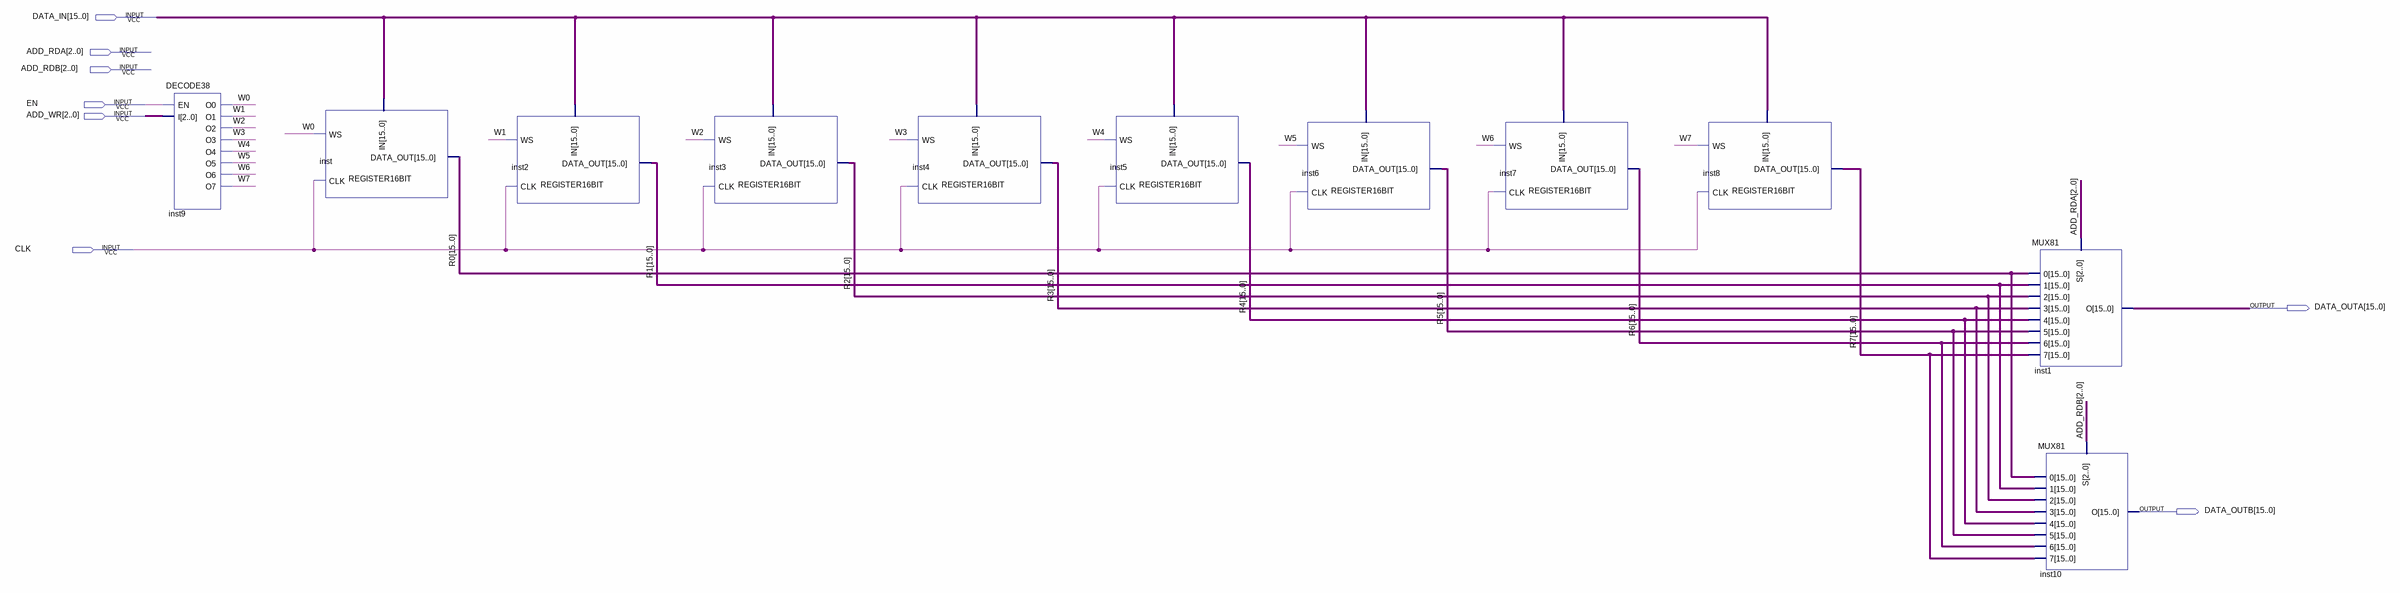
[diagram p0: schematic sheet]
// Quartus schematic RF8X16.bdf as structural Verilog: 11 symbols, 8 pins
module RF8X16 (
  input  [15:0] DATA_IN,
  input  [2:0] ADD_RDA,
  input  [2:0] ADD_RDB,
  input  EN,
  input  [2:0] ADD_WR,
  input  CLK,
  output [15:0] DATA_OUTA,
  output [15:0] DATA_OUTB
);

  wire W0, W1, W2, W3, W4, W5, W6, W7;
  wire [15:0] R0, R1, R2, R3, R4, R5, R6, R7;

  DECODE38 inst9 (.EN(EN), .I(ADD_WR), .O0(W0), .O1(W1), .O2(W2), .O3(W3), .O4(W4), .O5(W5), .O6(W6), .O7(W7));
  REGISTER16BIT inst (.IN(DATA_IN), .WS(W0), .CLK(CLK), .DATA_OUT(R0));
  REGISTER16BIT inst2 (.IN(DATA_IN), .WS(W1), .CLK(CLK), .DATA_OUT(R1));
  REGISTER16BIT inst3 (.IN(DATA_IN), .WS(W2), .CLK(CLK), .DATA_OUT(R2));
  REGISTER16BIT inst4 (.IN(DATA_IN), .WS(W3), .CLK(CLK), .DATA_OUT(R3));
  REGISTER16BIT inst5 (.IN(DATA_IN), .WS(W4), .CLK(CLK), .DATA_OUT(R4));
  REGISTER16BIT inst6 (.IN(DATA_IN), .WS(W5), .CLK(CLK), .DATA_OUT(R5));
  REGISTER16BIT inst7 (.IN(DATA_IN), .WS(W6), .CLK(CLK), .DATA_OUT(R6));
  REGISTER16BIT inst8 (.IN(DATA_IN), .WS(W7), .CLK(CLK), .DATA_OUT(R7));
  MUX81 inst1 (
    .S(ADD_RDA), .\0 (R0), .\1 (R1), .\2 (R2), .\3 (R3), .\4 (R4), .\5 (R5), .\6 (R6), .\7 (R7), .O(DATA_OUTA));
  MUX81 inst10 (
    .S(ADD_RDB), .\0 (R0), .\1 (R1), .\2 (R2), .\3 (R3), .\4 (R4), .\5 (R5), .\6 (R6), .\7 (R7), .O(DATA_OUTB));
endmodule
